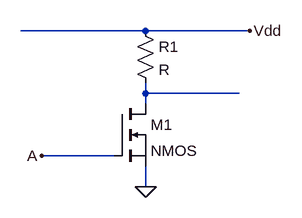
[diagram p0: schematic NMOS NOT.asc]
NMOS NOT.asc, the LTspice schematic file:
Version 4
SHEET 1 880 680
WIRE 208 64 16 64
WIRE 368 64 208 64
WIRE 208 160 208 144
WIRE 352 160 208 160
WIRE 208 176 208 160
WIRE 160 256 48 256
WIRE 208 304 208 272
FLAG 208 304 0
FLAG 48 256 A
FLAG 368 64 Vdd
SYMBOL nmos 160 176 R0
SYMATTR InstName M1
SYMBOL res 192 48 R0
SYMATTR InstName R1

The netlist it stands for:
* NMOS NOT.asc
M1 N001 A 0 0 NMOS
R1 Vdd N001 R
.model NMOS NMOS
.model PMOS PMOS
.lib standard.mos
.backanno
.end